# EAGLE design photocell mk3 (EAGLE 6.5.0)
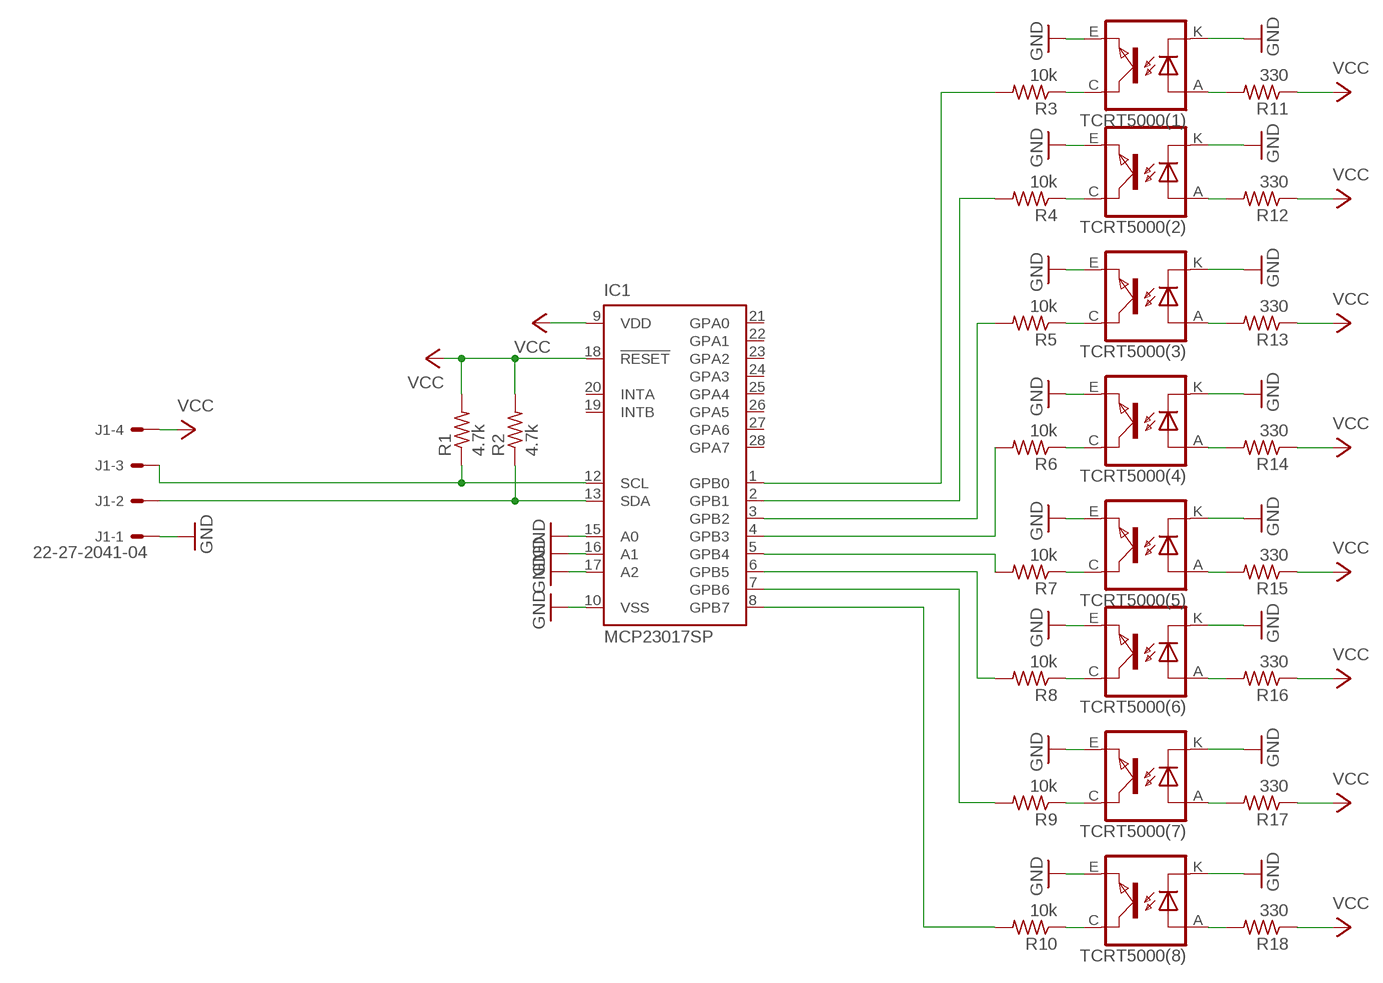
[diagram p0: schematic, sheet 1]

## Parts
IC1  MCP23017SP  [DIL28-3]
J1  22-27-2041-04  [6410-04]
R1  4.7k  R-US_0204/7  [0204/7]
R2  4.7k  R-US_0204/7  [0204/7]
R3  10k  R-US_0204/7  [0204/7]
R4  10k  R-US_0204/7  [0204/7]
R5  10k  R-US_0204/7  [0204/7]
R6  10k  R-US_0204/7  [0204/7]
R7  10k  R-US_0204/7  [0204/7]
R8  10k  R-US_0204/7  [0204/7]
R9  10k  R-US_0204/7  [0204/7]
R10  10k  R-US_0204/7  [0204/7]
R11  330  R-US_0204/7  [0204/7]
R12  330  R-US_0204/7  [0204/7]
R13  330  R-US_0204/7  [0204/7]
R14  330  R-US_0204/7  [0204/7]
R15  330  R-US_0204/7  [0204/7]
R16  330  R-US_0204/7  [0204/7]
R17  330  R-US_0204/7  [0204/7]
R18  330  R-US_0204/7  [0204/7]
TCRT5000(1)  TCRT5000  [TCRT5000]
TCRT5000(2)  TCRT5000  [TCRT5000]
TCRT5000(3)  TCRT5000  [TCRT5000]
TCRT5000(4)  TCRT5000  [TCRT5000]
TCRT5000(5)  TCRT5000  [TCRT5000]
TCRT5000(6)  TCRT5000  [TCRT5000]
TCRT5000(7)  TCRT5000  [TCRT5000]
TCRT5000(8)  TCRT5000  [TCRT5000]

## Nets
GND: IC1.10(VSS) IC1.15(A0) IC1.16(A1) IC1.17(A2) J1.1 TCRT5000(1).E(EMITTER) TCRT5000(1).K(CATHODE) TCRT5000(2).E(EMITTER) TCRT5000(2).K(CATHODE) TCRT5000(3).E(EMITTER) TCRT5000(3).K(CATHODE) TCRT5000(4).E(EMITTER) TCRT5000(4).K(CATHODE) TCRT5000(5).E(EMITTER) TCRT5000(5).K(CATHODE) TCRT5000(6).E(EMITTER) TCRT5000(6).K(CATHODE) TCRT5000(7).E(EMITTER) TCRT5000(7).K(CATHODE) TCRT5000(8).E(EMITTER) TCRT5000(8).K(CATHODE)
N$1: IC1.6(GPB5) R8.2
N$2: R18.2 TCRT5000(8).A(ANODE)
N$3: R10.1 TCRT5000(8).C(COLLECTOR)
N$4: R9.1 TCRT5000(7).C(COLLECTOR)
N$5: IC1.7(GPB6) R9.2
N$6: R17.2 TCRT5000(7).A(ANODE)
N$7: IC1.8(GPB7) R10.2
N$8: R8.1 TCRT5000(6).C(COLLECTOR)
N$9: IC1.5(GPB4) R7.2
N$10: IC1.4(GPB3) R6.2
N$11: R16.2 TCRT5000(6).A(ANODE)
N$12: IC1.3(GPB2) R5.2
N$13: R7.1 TCRT5000(5).C(COLLECTOR)
N$14: IC1.2(GPB1) R4.2
N$15: IC1.1(GPB0) R3.2
N$17: IC1.12(SCL) J1.3 R1.1
N$18: IC1.13(SDA) J1.2 R2.1
N$19: R6.1 TCRT5000(4).C(COLLECTOR)
N$20: R14.2 TCRT5000(4).A(ANODE)
N$21: R5.1 TCRT5000(3).C(COLLECTOR)
N$23: R13.2 TCRT5000(3).A(ANODE)
N$24: R4.1 TCRT5000(2).C(COLLECTOR)
N$25: R12.2 TCRT5000(2).A(ANODE)
N$26: R3.1 TCRT5000(1).C(COLLECTOR)
N$27: R11.2 TCRT5000(1).A(ANODE)
TCRT5000(5): R15.2 TCRT5000(5).A(ANODE)
VCC: IC1.9(VDD) IC1.18(!RESET) J1.4 R1.2 R2.2 R11.1 R12.1 R13.1 R14.1 R15.1 R16.1 R17.1 R18.1
Unconnected: IC1.19(INTB) IC1.20(INTA) IC1.21(GPA0) IC1.22(GPA1) IC1.23(GPA2) IC1.24(GPA3) IC1.25(GPA4) IC1.26(GPA5) IC1.27(GPA6) IC1.28(GPA7)

## Library data of the parts
IC1 = microchip:MCP23017: http://ww1.microchip.com/downloads/en/DeviceDoc/21952a.pdf Source: http://ww1.microchip.com/downloads/en/DeviceDoc/21952a.pdf; MF: MICROCHIP; MPN: MCP23017-E/SP; OC_FARNELL: 1332088; OC_NEWARK: 31K2959
J1 = con-molex:22-?-04: CONNECTOR wire to board 2.54 mm (.1 inch) pitch header; OC_FARNELL: unknown; OC_NEWARK: unknown
R1-R18 = resistor:R-US_: RESISTOR, American symbol; OC_NEWARK: unknown
TCRT5000(1) TCRT5000(2) TCRT5000(3) TCRT5000(4) TCRT5000(5) TCRT5000(6) TCRT5000(7) TCRT5000(8) = tcrt5000:TCRT5000; OC_NEWARK: unknown

## Net classes
0 default: width 0.305 mm, drill 0.508 mm, clearance 0.254 mm

## Board
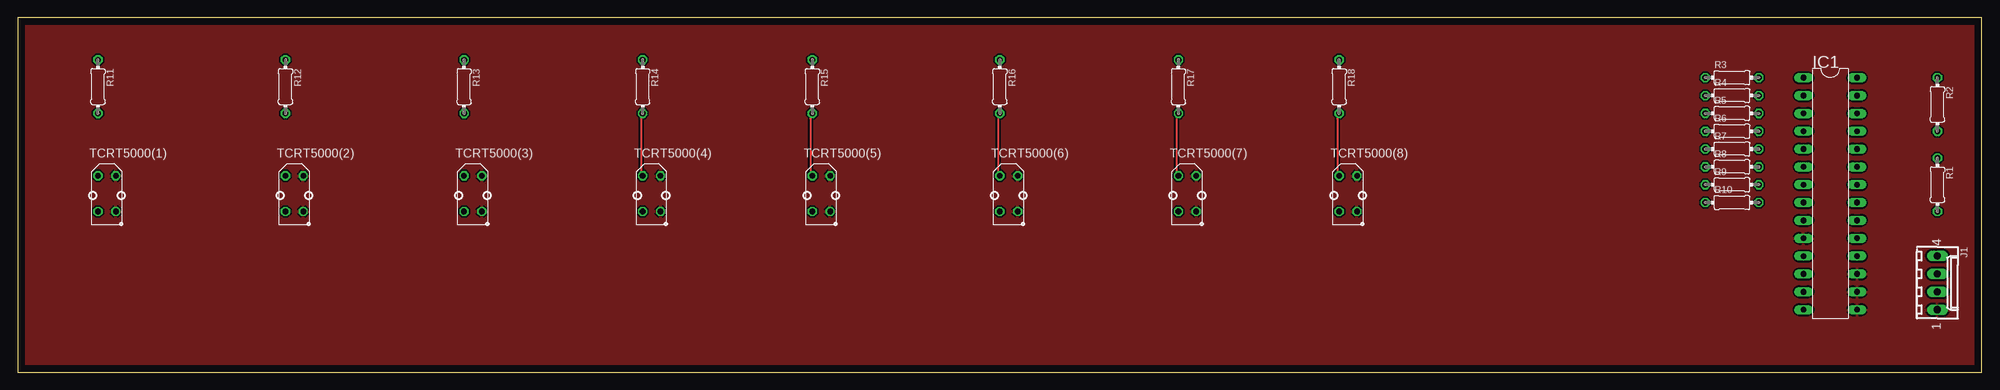
[diagram p1: board, top side]
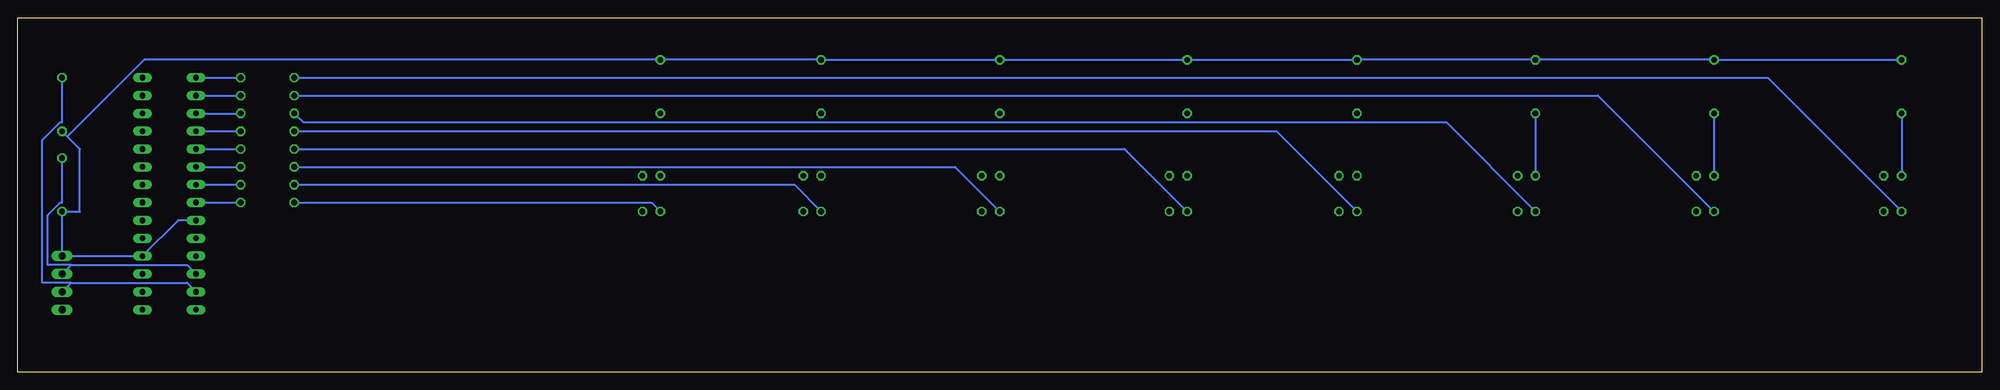
[diagram p2: board, bottom side, seen from below]

Size 279.38 x 50.47 mm. Coordinates in mm from the lower left corner, seen from the top.
Outline: 0,0 279.38,0 279.38,50.47 0,50.47 0,0
Copper layers (1*16): Top 0.035mm / dielectric 1.5mm / Bottom 0.035mm
Design rules "default": minimum track width 10mil, minimum drill 24mil, track to track 8mil, track to pad 8mil, pad to pad 8mil, via to via 8mil, smd to smd 8mil, copper to edge 40mil, drill to drill 8mil, minimum pad ring 10mil, minimum via ring 8mil, stop-mask expansion 4mil, vias tented up to drill 0mil, thermal gap 10mil

### Footprints (pad centres in the part's own frame; a part is rotated, then mirrored left to right if it is on the bottom)
DIL28-3 = drill 0.813 long: 1 -16.51,-3.81; 2 -13.97,-3.81; 3 -11.43,-3.81; 4 -8.89,-3.81; 5 -6.35,-3.81; 6 -3.81,-3.81; 7 -1.27,-3.81; 8 1.27,-3.81; 9 3.81,-3.81; 10 6.35,-3.81; 11 8.89,-3.81; 12 11.43,-3.81; 13 13.97,-3.81; 14 16.51,-3.81; 15 16.51,3.81; 16 13.97,3.81; 17 11.43,3.81; 18 8.89,3.81; 19 6.35,3.81; 20 3.81,3.81; 21 1.27,3.81; 22 -1.27,3.81; 23 -3.81,3.81; 24 -6.35,3.81; 25 -8.89,3.81; 26 -11.43,3.81; 27 -13.97,3.81; 28 -16.51,3.81
6410-04 = drill 1.016 long: 1 3.81,0; 2 1.27,0; 3 -1.27,0; 4 -3.81,0
0204/7 = drill 0.813 octagon: 1 -3.81,0; 2 3.81,0
TCRT5000 = drill 0.8 octagon: A -2.54,-1.27; C 2.54,-1.27; E 2.54,1.27; K -2.54,1.27

### Placement (x,y rotation side)
IC1  257.81,25.4 270 top
J1  273.05,12.7 270 top
R1  273.05,26.67 270 top
R2  273.05,38.1 270 top
R3  243.84,41.91 0 top
R4  243.84,39.37 0 top
R5  243.84,36.83 0 top
R6  243.84,34.29 0 top
R7  243.84,31.75 0 top
R8  243.84,29.21 0 top
R9  243.84,26.67 0 top
R10  243.84,24.13 0 top
R11  11.43,40.64 270 top
R12  38.1,40.64 270 top
R13  63.5,40.64 270 top
R14  88.9,40.64 270 top
R15  113.03,40.64 270 top
R16  139.7,40.64 270 top
R17  165.1,40.64 270 top
R18  187.96,40.64 270 top
TCRT5000(1)  12.7,25.4 270 top
TCRT5000(2)  39.37,25.4 270 top
TCRT5000(3)  64.77,25.4 270 top
TCRT5000(4)  90.17,25.4 270 top
TCRT5000(5)  114.3,25.4 270 top
TCRT5000(6)  140.97,25.4 270 top
TCRT5000(7)  166.37,25.4 270 top
TCRT5000(8)  189.23,25.4 270 top

### Tracks (layer width: path | path; a pad name or v marks a point on that pad's centre or on a via)
GND
  pour Top: -1.27,50.8 -1.27,-1.27 280.67,-1.27 280.67,52.07 -1.27,52.07
N$1
  Bottom 0.305: IC1.6 R8.2
N$2
  Top 0.305: TCRT5000(8).A 187.71,28.19 187.71,36.07 187.96,36.32 R18.2
N$3
  Bottom 0.305: TCRT5000(8).C 189.23,24.13 R10.1
N$4
  Bottom 0.305: TCRT5000(7).C 168.91,26.67 R9.1
N$5
  Bottom 0.305: IC1.7 R9.2
N$6
  Top 0.305: TCRT5000(7).A 164.85,28.19 164.85,36.07 165.1,36.32 R17.2
N$7
  Bottom 0.305: IC1.8 R10.2
N$8
  Bottom 0.305: TCRT5000(6).C 146.05,29.21 R8.1
N$9
  Bottom 0.305: IC1.5 R7.2
N$10
  Bottom 0.305: IC1.4 R6.2
N$11
  Top 0.305: TCRT5000(6).A 139.45,28.19 139.45,36.07 139.7,36.32 R16.2
N$12
  Bottom 0.305: IC1.3 R5.2
N$13
  Bottom 0.305: TCRT5000(5).C 121.92,31.75 R7.1
N$14
  Bottom 0.305: IC1.2 R4.2
N$15
  Bottom 0.305: IC1.1 R3.2
N$17
  Bottom 0.305: IC1.12 255.27,15.24 271.78,15.24 | J1.3 271.78,15.24 | R1.1 273.05,24.13 273.3,24.13 275.08,22.35 275.08,15.24 271.78,15.24
N$18
  Bottom 0.305: IC1.13 255.27,12.7 271.78,12.7 | J1.2 271.78,12.7 | R2.1 273.05,35.56 273.3,35.56 275.84,33.02 275.84,12.7 271.78,12.7
N$19
  Bottom 0.305: TCRT5000(4).C 100.33,34.29 R6.1
N$20
  Top 0.305: TCRT5000(4).A 88.65,28.19 88.65,36.07 88.9,36.32 R14.2
N$21
  Bottom 0.305: TCRT5000(3).C 76.2,35.56 238.76,35.56 R5.1
N$23
  Bottom 0.305: R13.2 TCRT5000(3).A
N$24
  Bottom 0.305: TCRT5000(2).C 54.61,39.37 R4.1
N$25
  Bottom 0.305: R12.2 TCRT5000(2).A
N$26
  Bottom 0.305: TCRT5000(1).C 30.48,41.91 R3.1
N$27
  Bottom 0.305: R11.2 TCRT5000(1).A
TCRT5000(5)
  Top 0.305: TCRT5000(5).A 112.78,28.19 112.78,36.07 113.03,36.32 R15.2
VCC
  Bottom 0.305: R11.1 R12.1 R13.1 R14.1 R15.1 R16.1 R17.1 R18.1 261.37,44.45 272.29,33.53 | IC1.9 256.54,21.59 IC1.18 J1.4 R1.2 270.51,22.86 270.51,31.75 272.29,33.53 | 272.29,33.53 R2.2